# Altium project STM32F103CBT6.PrjPcb
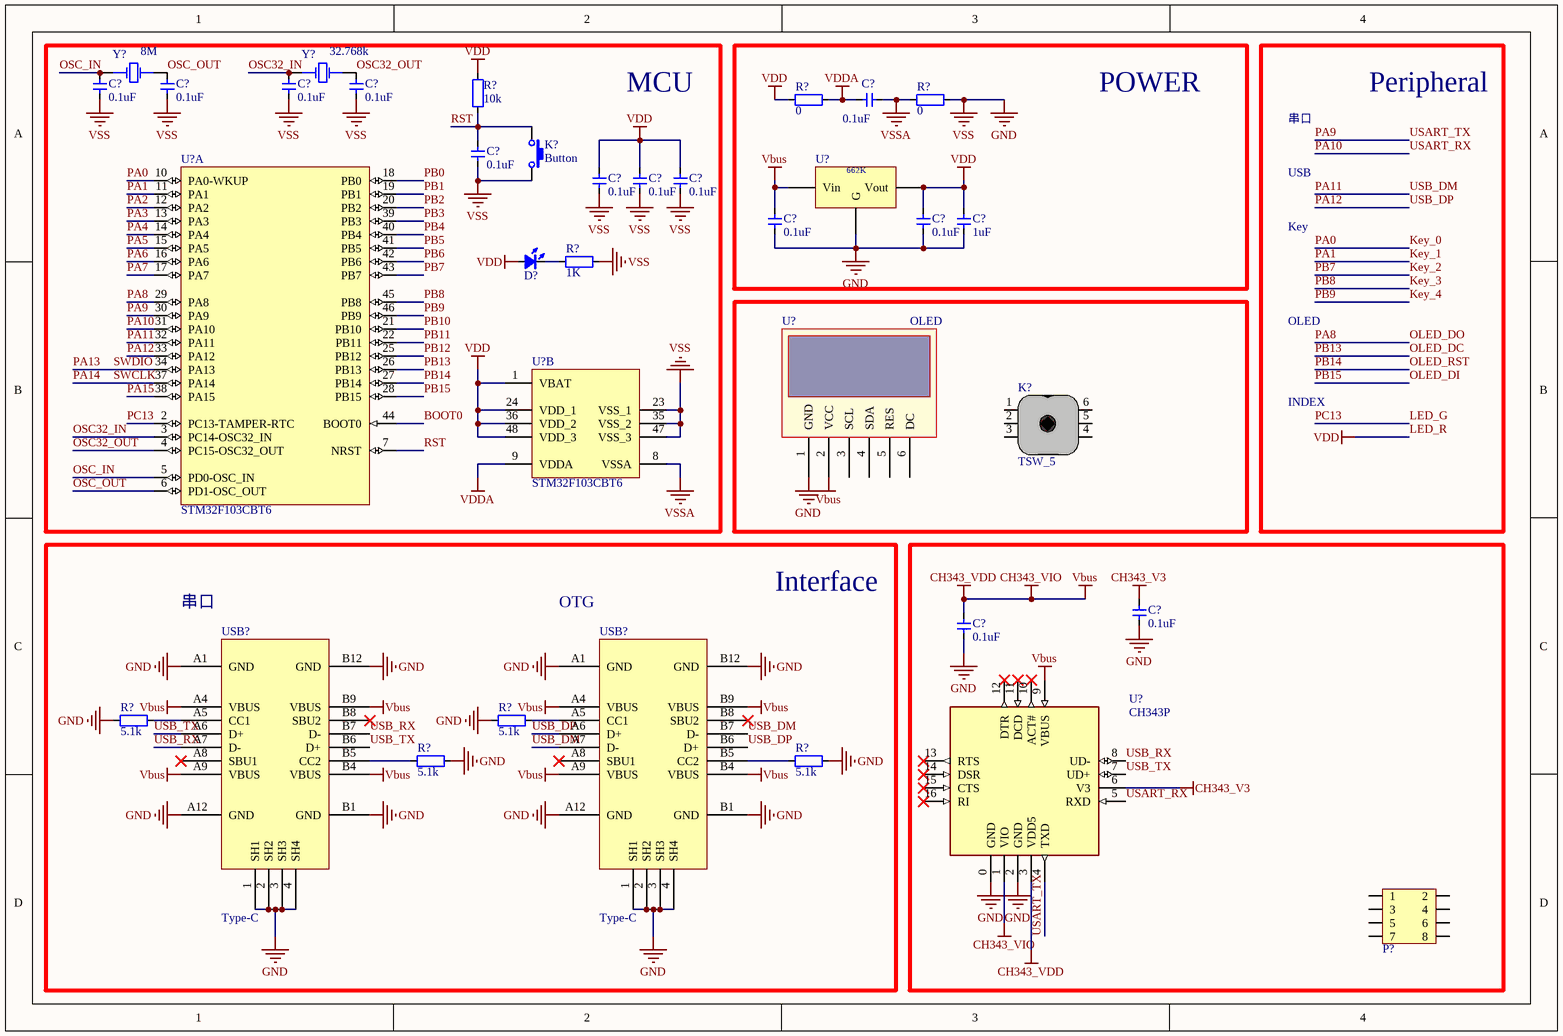
[diagram p0: Sheet1.SchDoc]
1 sheet, 35 parts. Net scope: global (net labels, ports and power ports of the same name join across sheets).

## Sheet Sheet1.SchDoc
size A4; SheetNumber: 1; SheetTotal: 1

### Parts
(Parts that share a designator on the sheet are numbered #1, #2 ... from top to bottom, then left to right.)
C?#1  0.1uF  [C0603]
C?#2  0.1uF  [C0603]
C?#3  0.1uF  [C0603]
C?#4  0.1uF  [C0603]
C?#5  0.1uF  [C0603]
C?#6  0.1uF  [C0603]
C?#7  0.1uF  [C0603]
C?#8  0.1uF  [C0603]
C?#9  0.1uF  [C0603]
C?#10  0.1uF  [C0603]
C?#11  0.1uF  [C0603]
C?#12  1uF  [C0603]
C?#13  0.1uF  [C0603]
C?#14  0.1uF  [C0603]
D?  color?  [LED0603]  (value not drawn)
K?#1  Button  [BUTTON-K2]
K?#2  TSW_5  [TSW-10]
P?  HDR2x4_2.54  [HDR2X4_2.54_180H]  (value not drawn)
R?#1  10k  [R0603]
R?#2  0  [R0603]
R?#3  0  [R0603]
R?#4  1K  [R0603]
R?#5  5.1k  [R0603]
R?#6  5.1k  [R0603]
R?#7  5.1k  [R0603]
R?#8  5.1k  [R0603]
U?#1  STM32F103CBT6  [STM-LQFP48_L]  (part A of 2)
U?#2  XC6206P332MR  [SOT95P280X120-3N]  (value not drawn)
U?#3  STM32F103CBT6  [STM-LQFP48_L]  (part B of 2)
U?#4  OLED  [OLED-12864-0.96-SPI]
U?#5  CH343P  [QFN16_3X3]
USB?#1  Type-C  [Type-C-TOP]
USB?#2  Type-C  [Type-C-TOP]
Y?#1  8M  [5032 2Pin]
Y?#2  XTAL 32.768KHz 2P  [3215 2Pin]  (value not drawn)

### Blocks framed on the sheet
MCU: C?#1-C?#4 C?#6-C?#9 D? K?#1 R?#1 R?#4 U?#1 U?#3 Y?#1 Y?#2
POWER: C?#5 C?#10-C?#12 R?#2 R?#3 U?#2
Interface: R?#5-R?#8 USB?#1 USB?#2

### Nets
CH343_V3: C?#13.2 U?#5.6(V3)
CH343_VDD: C?#10.2 C?#14.2 U?#2.3(Vin) U?#4.2(VCC) U?#5.1(VIO) U?#5.3(VDD5) U?#5.9(VBUS) USB?#1.A4(VBUS) USB?#1.A9(VBUS) USB?#1.B4(VBUS) USB?#1.B9(VBUS) USB?#2.A4(VBUS) USB?#2.A9(VBUS) USB?#2.B4(VBUS) USB?#2.B9(VBUS)  [also labelled CH343_VIO, Vbus]
GND: C?#1.1 C?#2.1 C?#3.1 C?#4.1 C?#6.1 C?#7.1 C?#8.1 C?#9.1 C?#10.1 C?#11.1 C?#12.1 C?#13.1 C?#14.1 K?#1.2 R?#3.2 R?#4.2 R?#5.1 R?#6.1 R?#7.2 R?#8.2 U?#2.1(G) U?#3.23(VSS_1) U?#3.35(VSS_2) U?#3.47(VSS_3) U?#4.1(GND) U?#5.0(GND) U?#5.2(GND) USB?#1.1(SH1) USB?#1.2(SH2) USB?#1.3(SH3) USB?#1.4(SH4) USB?#1.A1(GND) USB?#1.A12(GND) USB?#1.B1(GND) USB?#1.B12(GND) USB?#2.1(SH1) USB?#2.2(SH2) USB?#2.3(SH3) USB?#2.4(SH4) USB?#2.A1(GND) USB?#2.A12(GND) USB?#2.B1(GND) USB?#2.B12(GND)  [also labelled VSS]
LED_R: C?#7.2 C?#8.2 C?#9.2 C?#11.2 C?#12.2 D?.1(A) R?#1.2 R?#2.1 U?#2.2(Vout) U?#3.1(VBAT) U?#3.24(VDD_1) U?#3.36(VDD_2) U?#3.48(VDD_3)  [also labelled VDD]
VDDA: C?#5.1 R?#2.2 U?#3.9(VDDA)
VSSA: C?#5.2 R?#3.1 U?#3.8(VSSA)
BOOT0: U?#1.44(BOOT0)
Key_0: U?#1.10(PA0-WKUP)  [also labelled PA0]
Key_1: U?#1.11(PA1)  [also labelled PA1]
Key_2: U?#1.43(PB7)  [also labelled PB7]
Key_3: U?#1.45(PB8)  [also labelled PB8]
Key_4: U?#1.46(PB9)  [also labelled PB9]
LED_G: U?#1.2(PC13-TAMPER-RTC)  [also labelled PC13]
OLED_DC: U?#1.26(PB13)  [also labelled PB13]
OLED_DI: U?#1.28(PB15)  [also labelled PB15]
OLED_DO: U?#1.29(PA8)  [also labelled PA8]
OLED_RST: U?#1.27(PB14)  [also labelled PB14]
OSC32_IN: C?#3.2 U?#1.3(PC14-OSC32_IN) Y?#2.1(OSC1)
OSC32_OUT: C?#4.2 U?#1.4(PC15-OSC32_OUT) Y?#2.2(OSC2)
OSC_IN: C?#1.2 U?#1.5(PD0-OSC_IN) Y?#1.1(OSC1)
OSC_OUT: C?#2.2 U?#1.6(PD1-OSC_OUT) Y?#1.2(OSC2)
PA2: U?#1.12(PA2)
PA3: U?#1.13(PA3)
PA4: U?#1.14(PA4)
PA5: U?#1.15(PA5)
PA6: U?#1.16(PA6)
PA7: U?#1.17(PA7)
PA9: U?#1.30(PA9) U?#5.4(TXD)  [also labelled USART_TX]
PA10: U?#1.31(PA10) U?#5.5(RXD)  [also labelled USART_RX]
PA11: U?#1.32(PA11) USB?#2.A7(D-) USB?#2.B7(D-)  [also labelled USB_DM]
PA12: U?#1.33(PA12) USB?#2.A6(D+) USB?#2.B6(D+)  [also labelled USB_DP]
PA13: U?#1.34(PA13)  [also labelled SWDIO]
PA14: U?#1.37(PA14)  [also labelled SWCLK]
PA15: U?#1.38(PA15)
PB0: U?#1.18(PB0)
PB1: U?#1.19(PB1)
PB2: U?#1.20(PB2)
PB3: U?#1.39(PB3)
PB4: U?#1.40(PB4)
PB5: U?#1.41(PB5)
PB6: U?#1.42(PB6)
PB10: U?#1.21(PB10)
PB11: U?#1.22(PB11)
PB12: U?#1.25(PB12)
RST: C?#6.2 K?#1.1 R?#1.1 U?#1.7(NRST)
USB_RX: U?#5.8(UD-) USB?#1.A7(D-) USB?#1.B7(D-)
USB_TX: U?#5.7(UD+) USB?#1.A6(D+) USB?#1.B6(D+)
NetD?_2: D?.2(K) R?#4.1
NetR?#5_2: R?#5.2 USB?#1.A5(CC1)
NetR?#6_2: R?#6.2 USB?#2.A5(CC1)
NetR?#7_1: R?#7.1 USB?#1.B5(CC2)
NetR?#8_1: R?#8.1 USB?#2.B5(CC2)

Not connected (* = marked no-connect by the designer): K?#2 1 2 3 4 5 6; P? 1 2 3 4 5 6 7 8; U?#4 3(SCL) 4(SDA) 5(RES) 6(DC); U?#5 10(ACT#)* 11(DCD)* 12(DTR)* 13(RTS)* 14(DSR)* 15(CTS)* 16(RI)*; USB?#1 A8(SBU1)* B8(SBU2)*; USB?#2 A8(SBU1)* B8(SBU2)*

### Notes on the sheet
- Peripheral
- 串口
- USB
- Key
- OLED
- INDEX
- OTG
- (in symbol XC6206P332MR) 662K
- (in symbol XTAL 32.768KHz 2P) 32.768k

### Library data of the parts
C?#1-C?#14 = 贴片C: Capacitor; Value: 104; Published: 8-Jun-2000; LatestRevisionDate: 17-Jul-2002; LatestRevisionNote: Re-released for DXP Platform.; PackageReference: RAD-0.3; Publisher: Altium Limited
D? = 贴片LED: LED; Type: 0402; Value: color?
K?#2 = TSW_5: 方向开关
P? = HDR2x4_2.54: Header
R?#1-R?#3 R?#5-R?#8 = 贴片R: Resistor; Value: 1K; Published: 8-Jun-2000; Revision: July-2002: Re-released for DXP Platform.; Publisher: Altium Limited
R?#4 = 贴片R: Resistor; Published: 8-Jun-2000; Revision: July-2002: Re-released for DXP Platform.; Publisher: Altium Limited; Value: 1K
U?#1 U?#3 = STM32F103CBT6: ARM Cortex-M3 32-bit MCU, 128 KB Flash, 20 KB Internal RAM, 37 I/Os, 48-pin LQFP, -40 to 85 degC, Tray; Supply Voltage(Vcc) min (V): 2; Operating Frequency(F) (Processor speed) (MHz): 72; A/D Converter: 2x12-bit (10 Channel); FLASH Size (Prog) (kB): 128; Internal RAM Size (kB): 20; I/Os (High Current): 37; ComponentLink2Description: Datasheet; PackageReference: LQFP48; PartNumber: STM32F103CBT6; ComponentLink1Description: Manufacturer URL; DatasheetVersion: Rev. 16; PackageVersion: Rev. 6, 06/2013; Packing: Tray; ComponentLink1URL: http://www.st.com/web/en/home.html; Mounting Technology: Surface Mount; ComponentLink3URL: http://www.st.com/st-web-ui/static/active/en/resource/technical/document/datasheet/DM00058181.pdf; PackageDescription: 48-Pin Low Profile Quad Flat Package, 7 x 7 mm Body, 0.5 mm Pitch; Core: ARM Cortex-M3; ComponentLink3Description: Package Specification; ComponentLink2URL: http://www.st.com/st-web-ui/static/active/en/resource/technical/document/datasheet/CD00161566.pdf
U?#4 = OLED_12864_SPI: 模块
U?#5 = CH343P: USB to high speed enhanced TTL Serial / UART
USB?#1 USB?#2 = USB-Type-C-TOP
Y?#1 = XTAL 8Mhz 2pin
K?#1 = Button: Published: 24-Mar-1999; LatestRevisionDate: 17-Jul-2002; LatestRevisionNote: Re-released for DXP Platform.; PackageReference: SPST-2; Publisher: Altium Limited
U?#2 = XC6206P332MR: HelpURL: E:\Altium\Help\pdf\OP07X.pdf